# Altium schematic sheet Power.SchDoc: Power
size A4; Date: 2015-07-24; ApprovedBy: Authuir; CheckedBy: Authuir; Author: Authuir; CompanyName: Authuir; DrawnBy: Authuir; Engineer: Authuir; CurrentDate: 2015-07-24; Time: 2015-07-24
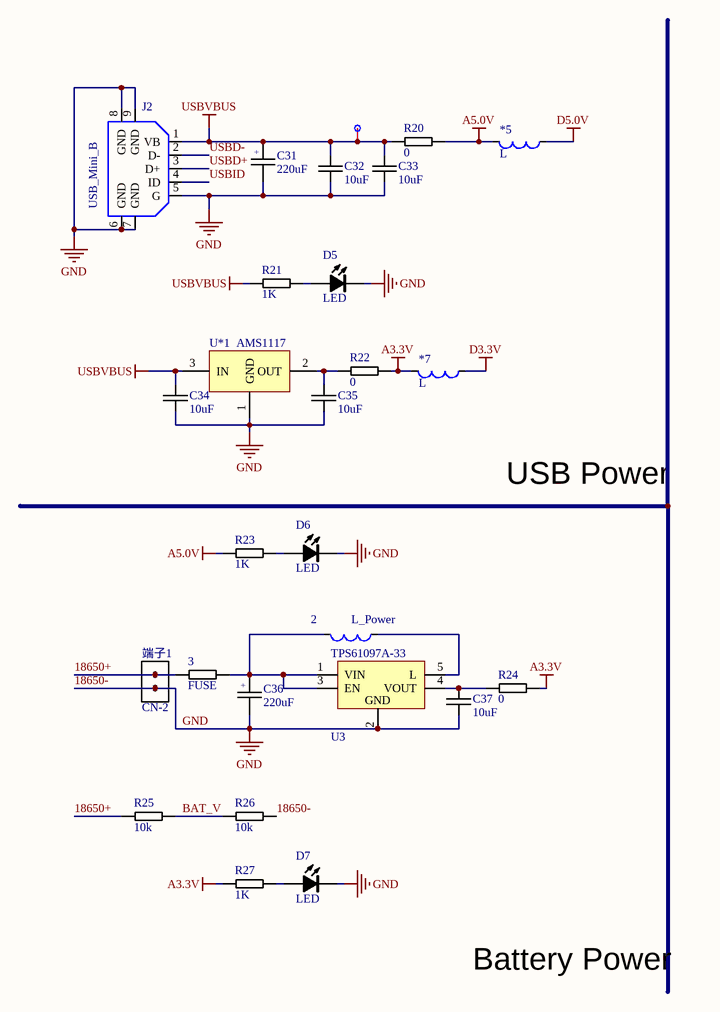
[diagram p0: Power.SchDoc]

## Parts
2  L_Power  [GDSD3316]
3  FUSE  [1812]
*5  L  [0805]
*6  Point  [Point]  (value not drawn)
*7  L  [0805]
C31  220uF  [钽电容7343]
C32  10uF  [0805-C]
C33  10uF  [0805-C]
C34  10uF  [0805-C]
C35  10uF  [0805-C]
C36  220uF  [钽电容7343]
C37  10uF  [0805-C]
D5  LED  [0805-LED]
D6  LED  [0805-LED]
D7  LED  [0805-LED]
J2  USB_Mini_B  [USB_Mini_B]
R20  0  [0805-R]
R21  1K  [0805-R]
R22  0  [0805-R]
R23  1K  [0805-R]
R24  0  [0805-R]
R25  10k  [0603]
R26  10k  [0603]
R27  1K  [0805-R]
U3  TPS61097A-33  [DBV005_L]  (value not drawn)
U*1  AMS1117  [SOT-223]
端子1  CN-2  [SIP-2]

## Nets
18650-: C31.1 C32.2 C33.2 C34.2 C35.2 C36.1 C37.2 D5.2(K) D6.2(K) D7.2(K) J2.5(G) J2.6(GND) J2.7(GND) J2.8(GND) J2.9(GND) R26.2 U3.2(GND) U*1.1(GND) 端子1.2  [also labelled GND]
A3.3V: *7.1 R22.2 R24.2 R27.1
A5.0V: *5.1 R20.2 R23.1
D3.3V: *7.2
D5.0V: *5.2
USBVBUS: *6.1(Point) C31.2 C32.1 C33.1 C34.1 J2.1(VB) R20.1 R21.1 U*1.3(IN)
18650+: 3.1 R25.1 端子1.1
BAT_V: R25.2 R26.1
USBD+: J2.3(D+)
USBD-: J2.2(D-)
USBID: J2.4(ID)
Net2_1: 2.1 3.2 C36.2 U3.1(VIN) U3.3(EN)
Net2_2: 2.2 U3.5(L)
NetC35_1: C35.1 R22.1 U*1.2(OUT)
NetC37_1: C37.1 R24.1 U3.4(VOUT)
NetD5_1: D5.1(A) R21.2
NetD6_1: D6.1(A) R23.2
NetD7_1: D7.1(A) R27.2

## Notes on the sheet
- USB Power
- Battery Power
- (in symbol 钽电容) +

## Library data of the parts
C31 C36 = 钽电容
C32-C35 C37 = CAP_Chip: 贴片
D5-D7 = LED: 贴片
R20-R27 = RES_Chip: 贴片